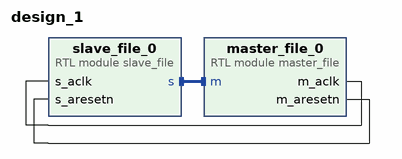
[diagram p0: block diagram of the top level]
# Vivado block design design_1, Vivado 2016.2
create_bd_design design_1

create_bd_cell -type module -reference master_file master_file_0
create_bd_cell -type module -reference slave_file slave_file_0

# ---- connections ----

connect_bd_intf_net [get_bd_intf_pins slave_file_0/s] [get_bd_intf_pins master_file_0/m]
connect_bd_net [get_bd_pins master_file_0/m_aclk] [get_bd_pins slave_file_0/s_aclk]
connect_bd_net [get_bd_pins master_file_0/m_aresetn] [get_bd_pins slave_file_0/s_aresetn]

validate_bd_design
save_bd_design
